# Altium schematic sheet RTL8211F_CONFIG.SchDoc
size A3; SheetNumber: 6; SheetTotal: 22
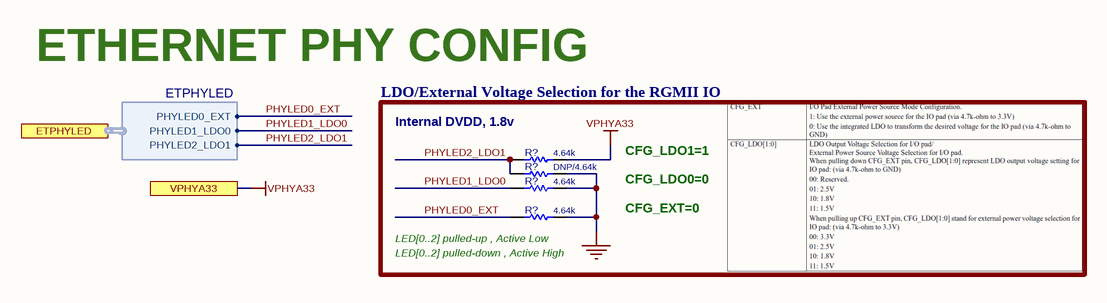
[diagram p0: RTL8211F_CONFIG.SchDoc]

## Parts
(Parts that share a designator on the sheet are numbered #1, #2 ... from top to bottom, then left to right.)
R?#1  4.64k  [R0402]
R?#2  DNP/4.64k  [R0402]
R?#3  4.64k  [R0402]
R?#4  4.64k  [R0402]

## Ports
ETPHYLED (harness ETPHYLED), VPHYA33

## Harnesses
ETPHYLED: PHYLED0_EXT, PHYLED1_LDO0, PHYLED2_LDO1

## Nets
GND: R?#2.2 R?#3.2 R?#4.2
VPHYA33: R?#1.2 ; port VPHYA33
PHYLED0_EXT: R?#4.1 ; port ETPHYLED.PHYLED0_EXT
PHYLED1_LDO0: R?#3.1 ; port ETPHYLED.PHYLED1_LDO0
PHYLED2_LDO1: R?#1.1 R?#2.1 ; port ETPHYLED.PHYLED2_LDO1

## Notes on the sheet
- ETHERNET PHY CONFIG
- LDO/External Voltage Selection for the RGMII IO
- (near R?#1) Internal DVDD, 1.8v
- CFG_LDO1=1
- CFG_EXT=0
- CFG_LDO0=0
- (near R?#4) LED[0..2] pulled-up , Active Low
- (near R?#4) LED[0..2] pulled-down , Active High

## Library data of the parts
R?#1-R?#4 = RES_SMD_10K_0402: RESISTOR, SMD; PARAM: 0.063W; DESC: DESCRIPTION; DIST#: MOUSER; PARAM2: 1%; MANF: -; ASSEMBLY: ASSEMBLY; PRICE: 100= 0.3$; MANF_P#: -
  R?#1 R?#3 R?#4: VALUE: 4.64k
  R?#2: VALUE: DNP/4.64k